# EAGLE design stem (EAGLE 9.6.2)
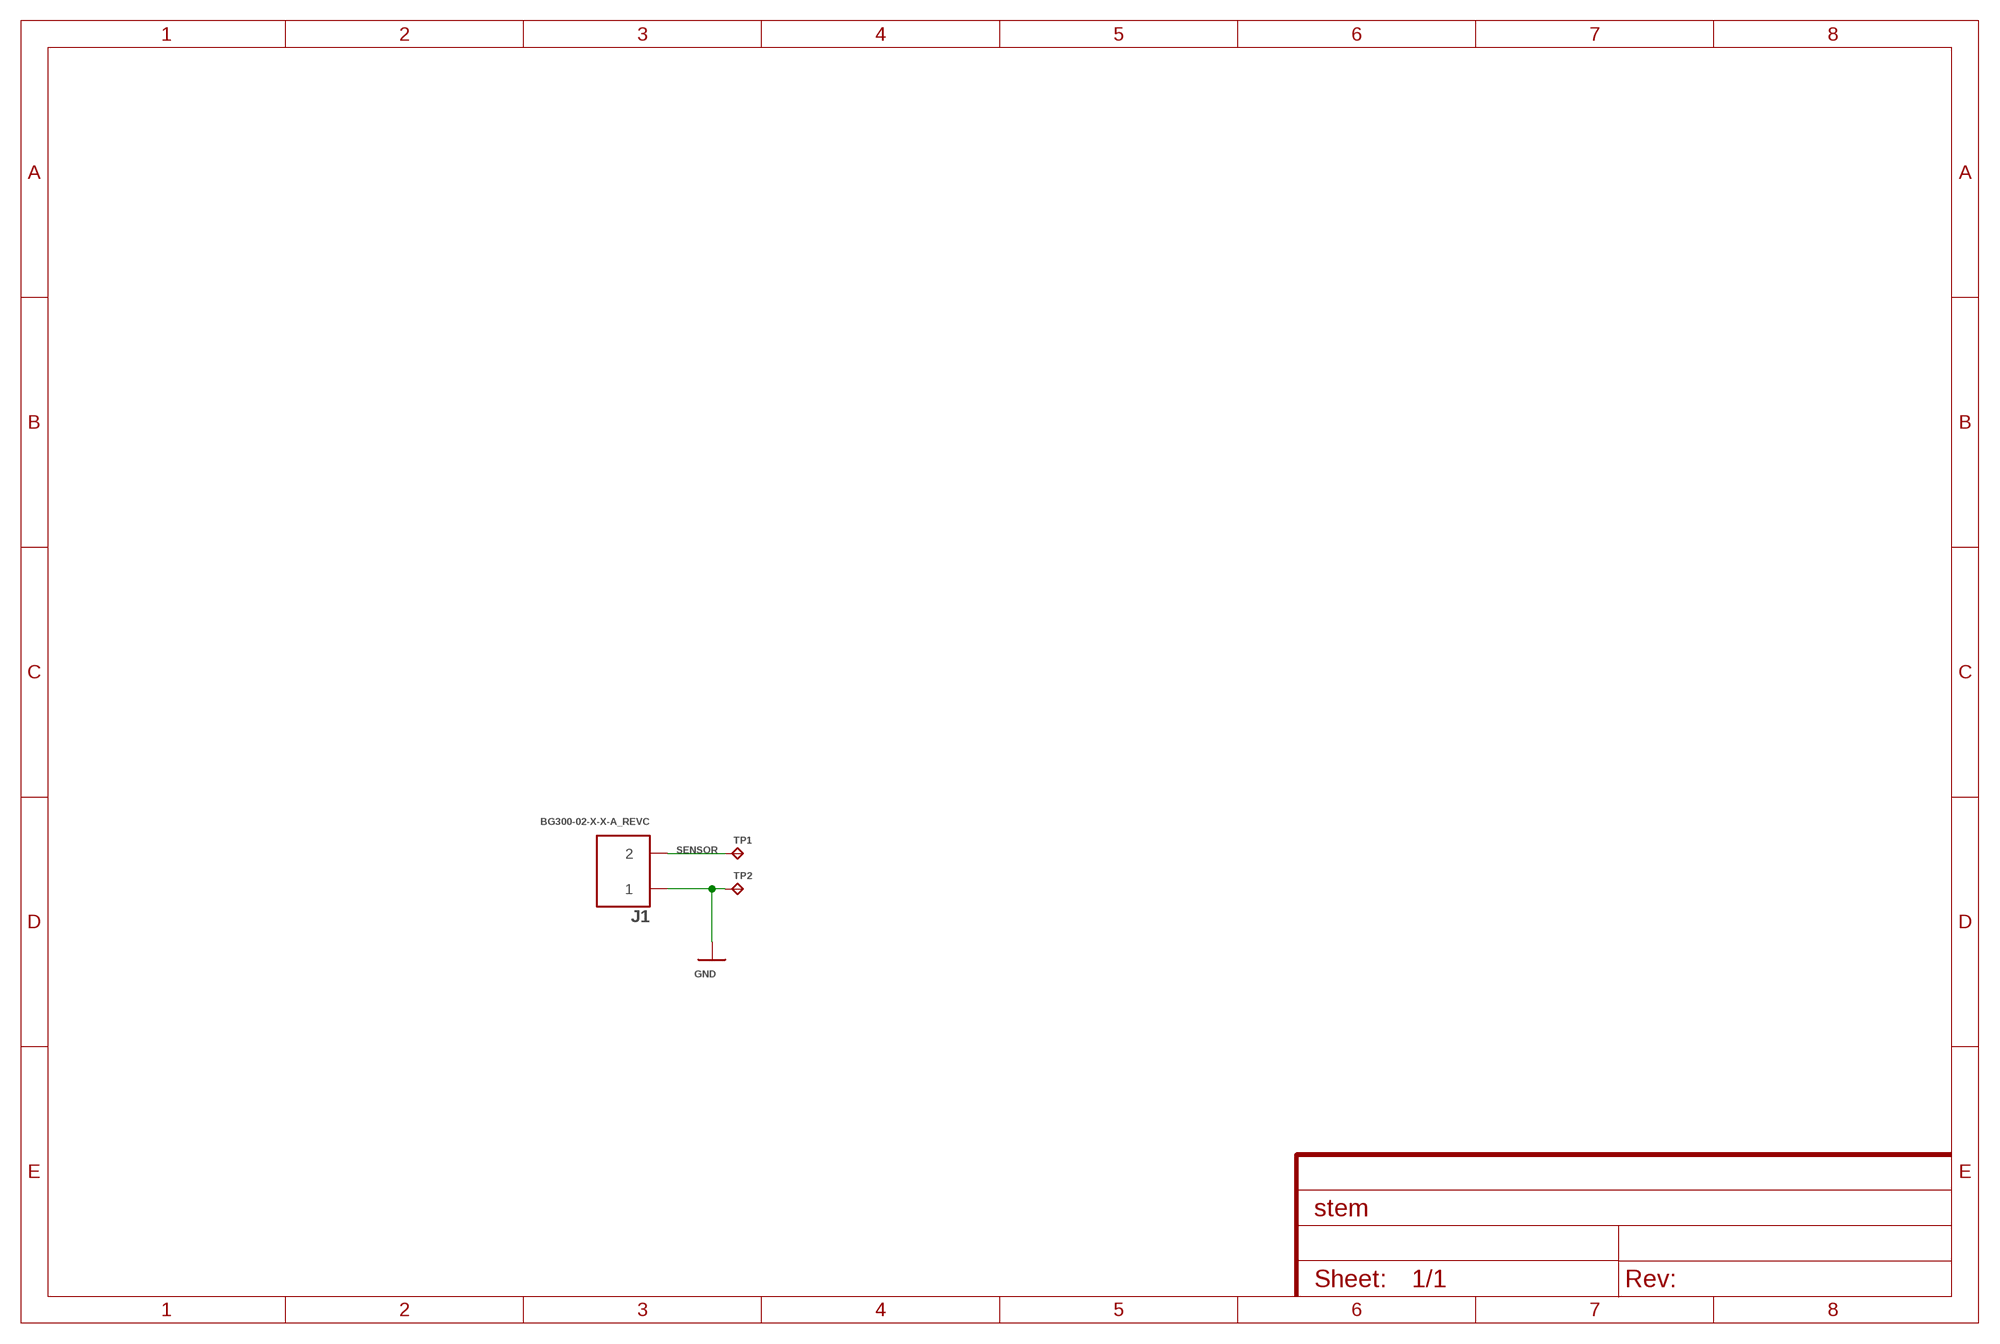
[diagram p0: schematic, sheet 1]

## Parts
J1  BG300-02-X-X-A_REVC  [GCT_BG300-02-X-X-A_REVC]
TP1  TPB1,27  [B1,27]
TP2  TPB1,27  [B1,27]

## Nets
GND: J1.1 TP2.TP
SENSOR: J1.2 TP1.TP

## Library data of the parts
J1 = BG300-02-X-X-A_REVC:BG300-02-X-X-A_REVC: 2.54mm Pitch Socket, Single Row, Surface Mount, Horizontal, Natural LCP Check availability <https://pricing.snapeda.com/parts/BG300-02-A-L-A/Global%20Connector%20Technology/view-part?ref=eda>; AVAILABILITY: In Stock; DESCRIPTION: 2 Position Receptacle Connector 0.100 (2.54mm) Surface Mount, Right Angle Gold; MF: Global Connector Technology; MP: BG300-02-A-L-A; PACKAGE: None; PRICE: None; PURCHASE-URL: https://pricing.snapeda.com/search/part/BG300-02-A-L-A/?ref=eda
TP1 TP2 = testpad:TP: Test pad

## Board
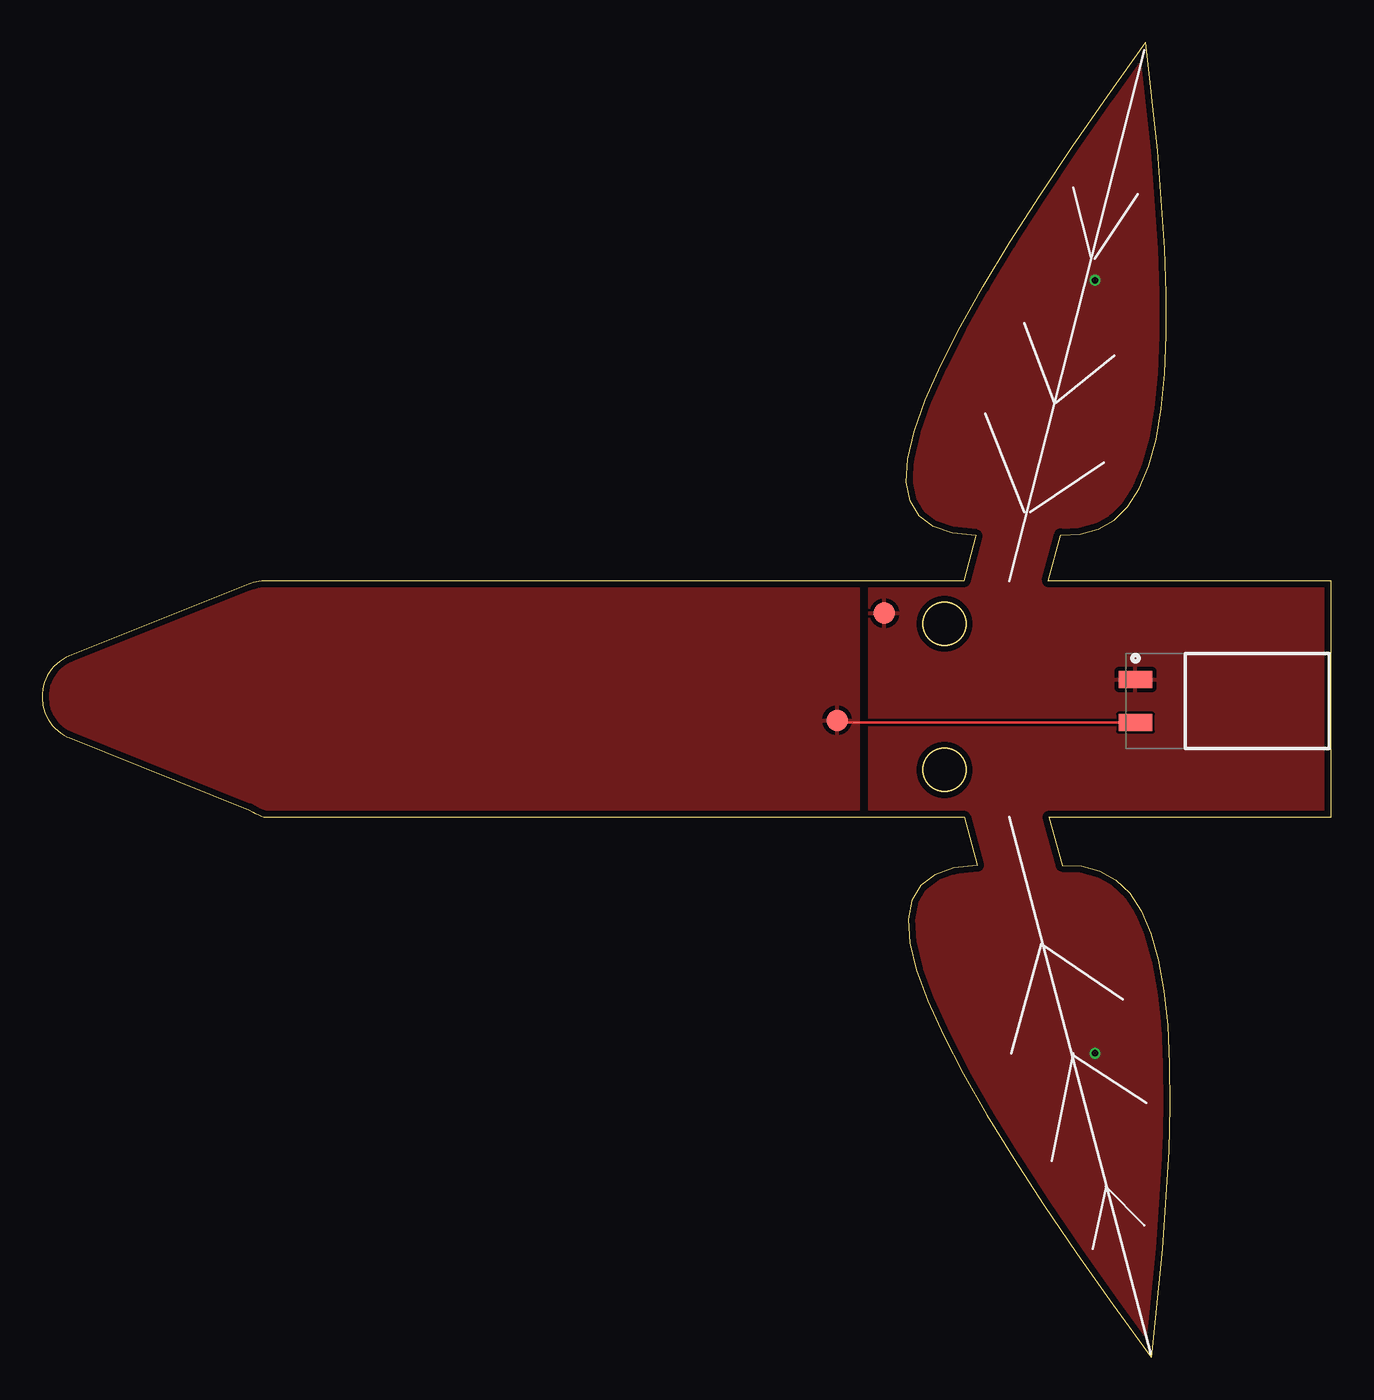
[diagram p1: board, top side]
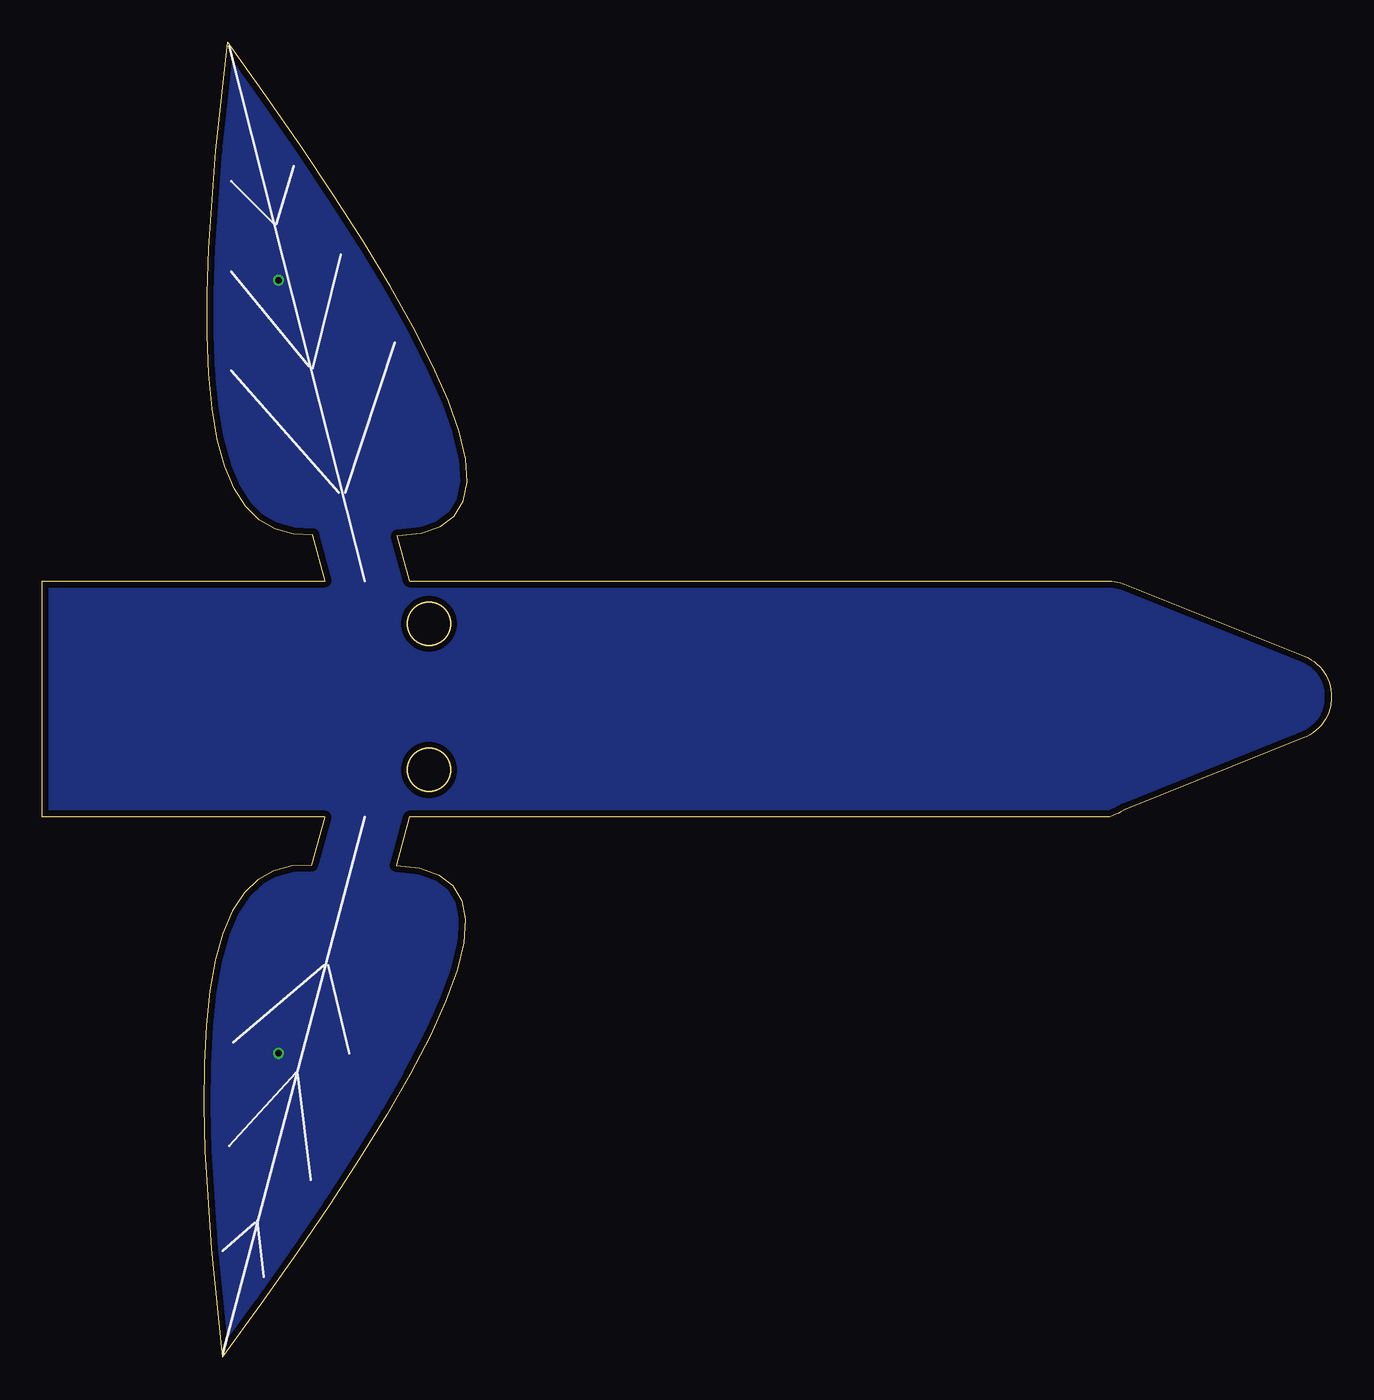
[diagram p2: board, bottom side, seen from below]

Size 76.2 x 77.76 mm. Coordinates in mm from the lower left corner, seen from the top.
Outline: 54.49,45.91 13.19,45.91 12.97,45.9 arc15 12.32,45.76 12.25,45.73 1.6,41.47 1.39,41.38 arc60 0,39.26 0,39.11 0,39 arc10 0.04,38.56 0.09,38.34 arc50 1.47,36.7 1.6,36.64 12.25,32.38 12.45,32.25 arc15 13.11,31.97 13.19,31.94 54.5,31.94 55.29,29.1 53.88,28.93 52.76,28.54 51.93,27.9 51.41,27.02 51.2,25.89 51.29,24.52 51.68,22.9 52.35,21.06 53.28,19.01 54.45,16.77 55.84,14.34 57.43,11.76 59.21,9.02 61.16,6.15 63.28,3.14 65.56,0 66.22,6.41 66.59,12.22 66.65,14.87 66.64,17.34 66.52,19.62 66.31,21.67 65.98,23.5 65.53,25.07 64.97,26.39 64.27,27.45 63.46,28.24 62.52,28.77 61.46,29.06 60.29,29.1 59.5,31.94 76.2,31.94 76.2,45.91 59.48,45.91 60.2,48.62 61.38,48.67 62.43,48.97 63.37,49.51 64.18,50.31 64.86,51.37 65.42,52.69 65.85,54.27 66.16,56.1 66.36,58.16 66.45,60.43 66.45,62.9 66.36,65.56 65.94,71.36 65.23,77.76 62.98,74.61 60.88,71.58 58.96,68.69 57.2,65.94 55.63,63.34 54.26,60.91 53.11,58.65 52.2,56.59 51.54,54.75 51.17,53.13 51.09,51.75 51.31,50.63 51.84,49.75 52.67,49.12 53.79,48.73 55.2,48.58 54.49,45.91
Outline: circle at 53.34,34.74 radius 1.27
Outline: circle at 53.34,43.37 radius 1.27
Copper layers (1*16): Top 0.035559375mm / dielectric 1.6mm / Bottom 0.035559375mm
Design rules "oshpark-2layer": minimum track width 6mil, minimum drill 10mil, track to track 6mil, track to pad 6mil, pad to pad 6mil, via to via 6mil, smd to smd 6mil, copper to edge 15mil, drill to drill 6mil, minimum pad ring 5mil, minimum via ring 5mil, stop-mask expansion 2.5mil, vias tented up to drill 0mil, thermal gap 10mil

### Footprints (pad centres in the part's own frame; a part is rotated, then mirrored left to right if it is on the bottom)
GCT_BG300-02-X-X-A_REVC = smd 1 x 2: 1 -1.27,-5.225; 2 1.27,-5.225
B1,27 = smd 1.27 x 1.27: TP 0,0

### Placement (x,y rotation side)
J1  69.85,38.8 270 top
TP1  46.99,37.66 0 top
TP2  49.78,44.01 0 top

### Tracks (layer width: path | path; a pad name or v marks a point on that pad's centre or on a via)
GND  (via drill 0.38)
  other vias: 62.23,63.69 62.23,17.97
  pour Top: 48.26,19.62 48.26,28.77 48.9,29.4 48.9,71.95 57.4,80.46 76.45,80.46 76.45,-1.2 53.76,-23.9 53.76,14.13
  pour Bottom: 10.16,-26.48 -41.91,25.59 -73.66,25.59 24.13,123.38 86.36,123.38 149.86,59.88 149.86,-18.86 121.92,-46.8 10.16,-46.8
SENSOR
  Top 0.152: J1.2 47.12,37.53 TP1.TP
  pour Top: 48.26,29.4 48.26,47.18 45.72,49.72 3.81,49.72 -1.27,44.64 -1.27,29.4